# Altium schematic sheet CAN_IF_Test.SchDoc
size A4; SheetNumber: 7; SheetTotal: 13
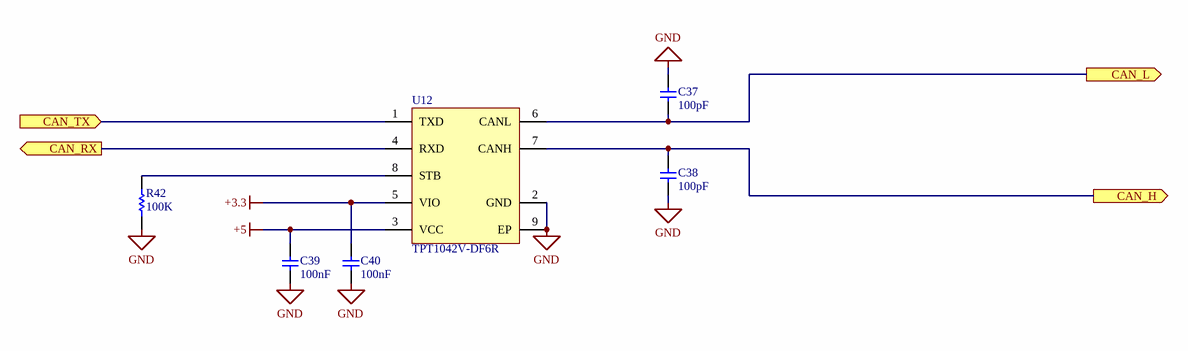
[diagram p0: CAN_IF_Test.SchDoc]

## Parts
C37  value 100pF  [0603M]  (hidden comment: Cap Ceramic)
C38  value 100pF  [0603M]  (hidden comment: Cap Ceramic)
C39  value 100nF  [0603M-C]  (hidden comment: Cap Ceramic)
C40  value 100nF  [0603M-C]  (hidden comment: Cap Ceramic)
R42  value 100K  [0603M]  (hidden comment: Resistor)
U12  TPT1042V-DF6R  [HVSON8-0.65mm]

## Ports
CAN_H (out, see 2HE2E_Tester), CAN_L (out, see 2HE2E_Tester), CAN_RX (out, see 2HE2E_Tester), CAN_TX (in, see 2HE2E_Tester)

## Nets
+3.3: C40.2 U12.5(VIO)
+5: C39.2 U12.3(VCC)
GND: C37.1 C38.1 C39.1 C40.1 R42.1 U12.2(GND) U12.9(EP)
CAN_H: C38.2 U12.7(CANH) ; port CAN_H
CAN_L: C37.2 U12.6(CANL) ; port CAN_L
CAN_RX: U12.4(RXD) ; port CAN_RX
CAN_TX: U12.1(TXD) ; port CAN_TX
NetR42_2: R42.2 U12.8(STB)

## Notes on the sheet
- Title
- Size:
- Date:
- A4
- Number:
- Time:
- Revision:
- Sheet
- of
- File:

## Library data of the parts
C37 C38 = Cap Ceramic: Ceramic Capacitor 50V
C39 C40 = Cap Ceramic: Ceramic Capacitor 25V
U12 = TPT1042V: High-speed CAN transceiver with Standby mode and VIO